# Altium schematic sheet HUI BUI 2.SchDoc
size A
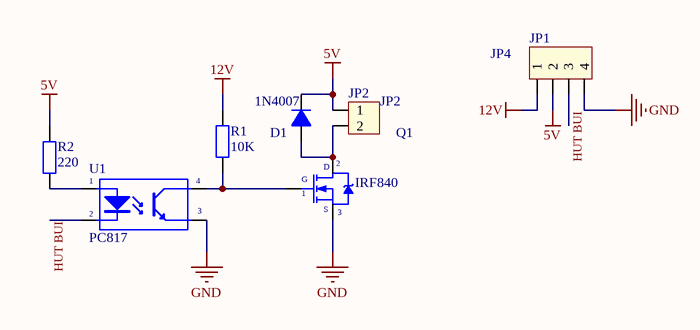
[diagram p0: HUI BUI 2.SchDoc]

## Parts
D1  1N4007  [D1A]
JP1  JP4  [CON4]
JP2  JP2  [CON2]
Q1  IRF840  [QTO-220]
R1  10K  [R1/4W]
R2  220  [R1/4W]
U1  PC817  [DIP4/W0.3]

## Nets
5V: D1.2(K) JP1.2 JP2.1 R2.1
12V: JP1.1 R1.2
GND: JP1.4 Q1.3(S) U1.3(E)
HUT BUI: JP1.3 U1.2(K)
NetD1_1: D1.1(A) JP2.2 Q1.2(D)
NetQ1_1: Q1.1(G) R1.1 U1.4(C)
NetR2_2: R2.2 U1.1(A)

## Library data of the parts
D1 = D1A: Diode 1A; Value: 1N4007
JP1 = Con4: Connector 4; Value: Connector 4
JP2 = Con2: Connector 2; Value: Connector 2
Q1 = IRF840: MOSFET N - CHANNEL 500V - 0.75 - 8A - TO-220; Value: IRF840
R1 R2 = R1/4W: Resistor 1/4W; Value: R1/4W - 1K
U1 = PC817: Single Opto; Value: PC817